# EAGLE design battery (EAGLE 9.5.0)
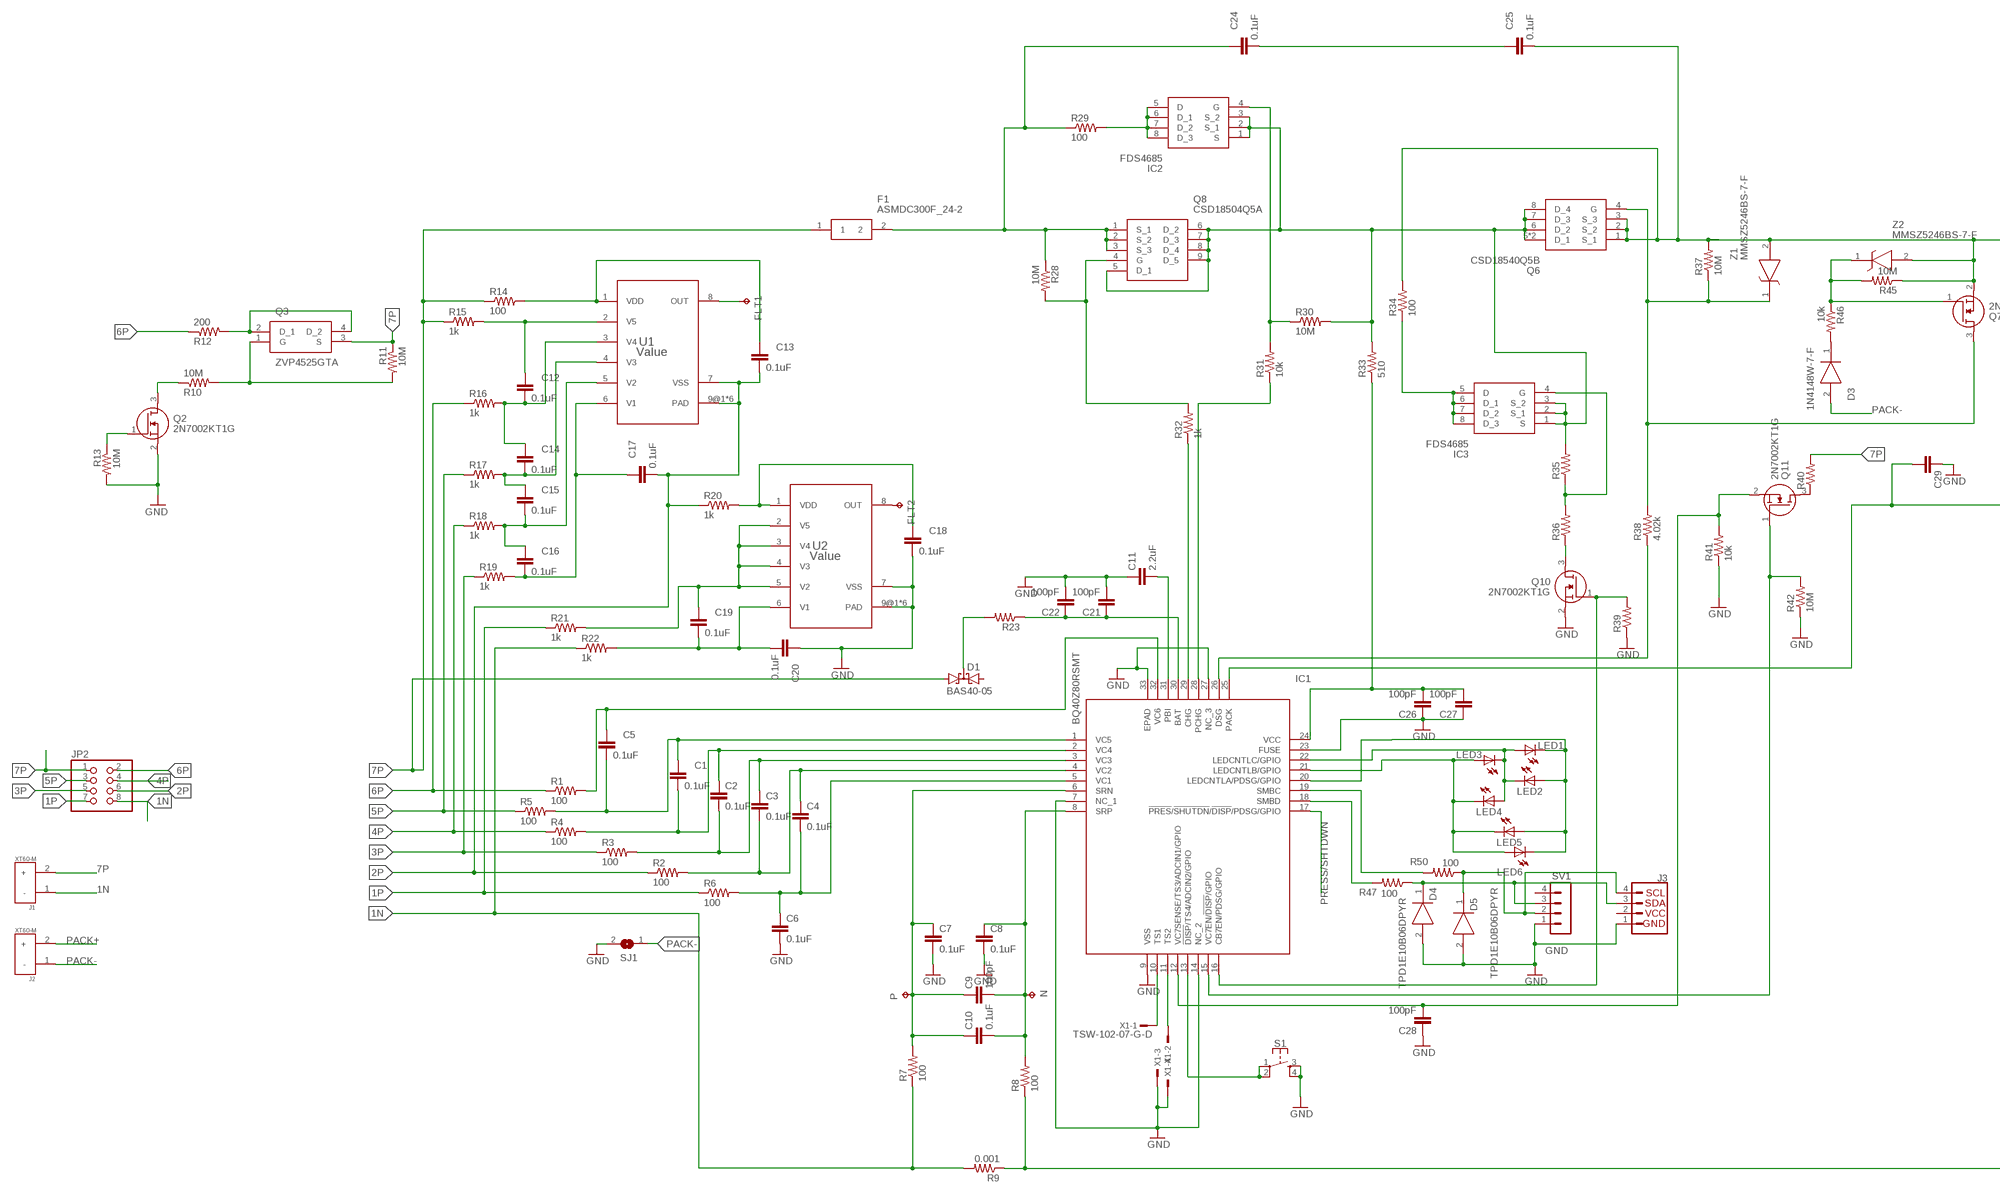
[diagram p0: schematic, sheet 1, part 1 of 2]
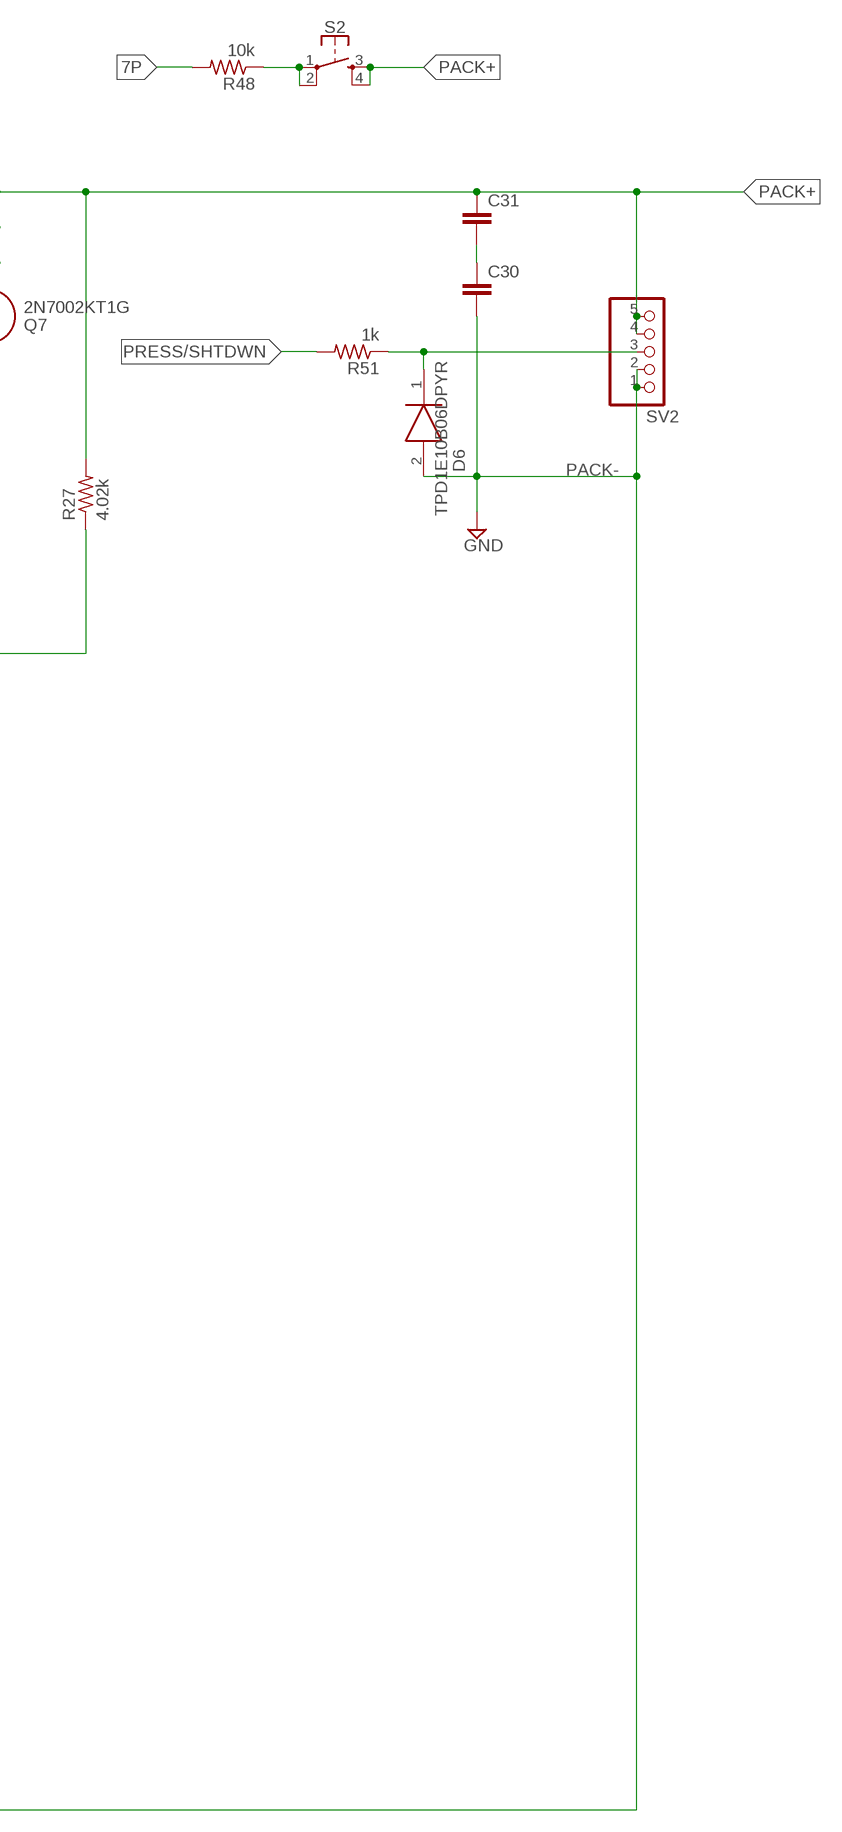
[diagram p1: schematic, sheet 1, part 2 of 2]

## Parts
C1  0.1uF  C-EUC0603  [C0603]
C2  0.1uF  C-EUC0603  [C0603]
C3  0.1uF  C-EUC0603  [C0603]
C4  0.1uF  C-EUC0603  [C0603]
C5  0.1uF  C-EUC0603  [C0603]
C6  0.1uF  C-EUC0603  [C0603]
C7  0.1uF  C-EUC0603  [C0603]
C8  0.1uF  C-EUC0603  [C0603]
C9  100pF  C-EUC0603  [C0603]
C10  0.1uF  C-EUC0603  [C0603]
C11  2.2uF  C-EUC1812  [C1812]
C12  0.1uF  C-EUC0603  [C0603]
C13  0.1uF  C-EUC0603  [C0603]
C14  0.1uF  C-EUC0603  [C0603]
C15  0.1uF  C-EUC0603  [C0603]
C16  0.1uF  C-EUC0603  [C0603]
C17  0.1uF  C-EUC0603  [C0603]
C18  0.1uF  C-EUC0603  [C0603]
C19  0.1uF  C-EUC0603  [C0603]
C20  0.1uF  C-EUC0603  [C0603]
C21  100pF  C-EUC0603  [C0603]
C22  100pF  C-EUC0603  [C0603]
C24  0.1uF  C-EUC0603  [C0603]
C25  0.1uF  C-EUC0603  [C0603]
C26  100pF  C-EUC0603  [C0603]
C27  100pF  C-EUC0603  [C0603]
C28  100pF  C-EUC0603  [C0603]
C29  C-EUC0603  [C0603]
C30  C-EUC0603  [C0603]
C31  C-EUC0603  [C0603]
D1  BAS40-05  [SOT23]
D3  1N4148W-7-F  [SOD3716X115N]
D4  TPD1E10B06DPYR  [DPY(R-PX1SON-N2)]
D5  TPD1E10B06DPYR  [DPY(R-PX1SON-N2)]
D6  TPD1E10B06DPYR  [DPY(R-PX1SON-N2)]
F1  ASMDC300F_24-2  [FUSC7551X110N]
FLT1  TPTP13R  [TP13R]
FLT2  TPTP13R  [TP13R]
IC1  BQ40Z80RSMT  [QFN40P400X400X100-33N]
IC2  FDS4685  [SOIC127P600X175-8N]
IC3  FDS4685  [SOIC127P600X175-8N]
J1  XT60-M  [AMASS_XT60-M]
J2  XT60-M  [AMASS_XT60-M]
J3  QWIIC_CONNECTORJS-1MM  [JST04_1MM_RA]
JP2  PINHD-2X4  [2X04]
LED1  LEDCHIPLED_0603  [CHIPLED_0603]
LED2  LEDCHIPLED_0603  [CHIPLED_0603]
LED3  LEDCHIPLED_0603  [CHIPLED_0603]
LED4  LEDCHIPLED_0603  [CHIPLED_0603]
LED5  LEDCHIPLED_0603  [CHIPLED_0603]
LED6  LEDCHIPLED_0603  [CHIPLED_0603]
N  TPTP13R  [TP13R]
P  TPTP13R  [TP13R]
Q2  2N7002KT1G  [SOT96P237X111-3N]
Q3  ZVP4525GTA  [SOT230P700X180-4N]
Q6  CSD18540Q5B  [Q5B]
Q7  2N7002KT1G  [SOT96P237X111-3N]
Q8  CSD18504Q5A  [CSD18514Q5AT]
Q10  2N7002KT1G  [SOT96P237X111-3N]
Q11  2N7002KT1G  [SOT96P237X111-3N]
R1  100  R-US_R0603  [R0603]
R2  100  R-US_R0603  [R0603]
R3  100  R-US_R0603  [R0603]
R4  100  R-US_R0603  [R0603]
R5  100  R-US_R0603  [R0603]
R6  100  R-US_R0603  [R0603]
R7  100  R-US_R0603  [R0603]
R8  100  R-US_R0603  [R0603]
R9  0.001  R-US_R1210  [R1210]
R10  10M  R-US_R0603  [R0603]
R11  10M  R-US_R0603  [R0603]
R12  200  R-US_R0603  [R0603]
R13  10M  R-US_R0603  [R0603]
R14  100  R-US_R0603  [R0603]
R15  1k  R-US_R0603  [R0603]
R16  1k  R-US_R0603  [R0603]
R17  1k  R-US_R0603  [R0603]
R18  1k  R-US_R0603  [R0603]
R19  1k  R-US_R0603  [R0603]
R20  1k  R-US_R0603  [R0603]
R21  1k  R-US_R0603  [R0603]
R22  1k  R-US_R0603  [R0603]
R23  R-US_R0603  [R0603]
R27  4.02k  R-US_R0603  [R0603]
R28  10M  R-US_R0603  [R0603]
R29  100  R-US_R1210  [R1210]
R30  10M  R-US_R0603  [R0603]
R31  10k  R-US_R0603  [R0603]
R32  1k  R-US_R0603  [R0603]
R33  510  R-US_R0603  [R0603]
R34  100  R-US_R1210  [R1210]
R35  R-US_R0603  [R0603]
R36  R-US_R0603  [R0603]
R37  10M  R-US_R0603  [R0603]
R38  4.02k  R-US_R0603  [R0603]
R39  R-US_R0603  [R0603]
R40  R-US_R0603  [R0603]
R41  10k  R-US_R0603  [R0603]
R42  10M  R-US_R0603  [R0603]
R45  10M  R-US_R0603  [R0603]
R46  10k  R-US_R0603  [R0603]
R47  100  R-US_R0603  [R0603]
R48  10k  R-US_R0603  [R0603]
R50  100  R-US_R0603  [R0603]
R51  1k  R-US_R0603  [R0603]
S1  MOMENTARY-SWITCH-SPST-2-SMD-4.6X2.8MM  [TACTILE_SWITCH_SMD_4.6X2.8MM]
S2  MOMENTARY-SWITCH-SPST-2-SMD-4.6X2.8MM  [TACTILE_SWITCH_SMD_4.6X2.8MM]
SJ1  SJ  [SJ]
SV1  MA04-1  [MA04-1]
SV2  PINHD-1X55X2MM  [1_05X2MM]
U1  Value  BQ771800DPJR  [DPJ0008A]
U2  Value  BQ771800DPJR  [DPJ0008A]
X1  TSW-102-07-G-D  [TSW-102-XX-G-D]
Z1  MMSZ5246BS-7-F  [SOD2513X110N]
Z2  MMSZ5246BS-7-F  [SOD2513X110N]

## Nets
1N: J1.1(-) JP2.8 R7.1 R9.2 R22.1
1P: JP2.7 R6.1 R21.1
2P: C13.2 C17.2 JP2.6 R2.1 R20.1 U1.7(VSS) U1.9@1(PAD) U1.9@2(PAD) U1.9@3(PAD) U1.9@4(PAD) U1.9@5(PAD) U1.9@6(PAD)
3P: JP2.5 R3.1 R19.1
4P: JP2.4 R4.1 R18.1
5P: JP2.3 R5.1 R17.1
6P: JP2.2 R1.1 R12.1 R16.1
7P: D1.1(A1) F1.1 J1.2(+) JP2.1 Q3.3(S) R11.1 R14.1 R15.1 R40.2 R48.2
GND: C6.2 C7.2 C8.2 C11.1 C18.2 C20.1 C21.2 C22.2 C26.1 C27.1 C28.1 C29.1 D4.2(GND) D5.2(GND) IC1.7(NC_1) IC1.9(VSS) IC1.14(NC_2) IC1.23(FUSE) IC1.27(NC_3) IC1.33(EPAD) J3.1 Q2.2(S) Q10.2(S) R13.2 R39.1 R41.1 R42.1 S1.3 S1.4 SJ1.2 SV1.1 U2.7(VSS) U2.9@1(PAD) U2.9@2(PAD) U2.9@3(PAD) U2.9@4(PAD) U2.9@5(PAD) U2.9@6(PAD) X1.3 X1.4
N$1: C1.1 C5.2 IC1.1(VC5) R5.2
N$2: C1.2 C2.1 IC1.2(VC4) R4.2
N$3: C2.2 C3.1 IC1.3(VC3) R3.2
N$4: C3.2 C4.1 IC1.4(VC2) R2.2
N$5: Q2.1(G) R13.1
N$6: C5.1 IC1.32(VC6) R1.2
N$7: C4.2 C6.1 IC1.5(VC1) R6.2
N$8: Q3.1(G) R10.2 R11.2
N$9: Q2.3(D) R10.1
N$10: Q3.2(D_1) Q3.4(D_2) R12.2
N$11: C13.1 R14.2 U1.1(VDD)
N$12: C12.1 R15.2 U1.2(V5)
N$13: C7.1 C9.1 C10.1 IC1.6(SRN) P.TP R7.2
N$14: C8.1 C9.2 C10.2 IC1.8(SRP) N.TP R8.2
N$15: C12.2 C14.1 R16.2 U1.3(V4)
N$17: C11.2 IC1.31(PBI)
N$18: D1.3(C) R23.2
N$19: C14.2 C15.1 R17.2 U1.4(V3)
N$20: C26.2 C27.2 IC1.24(VCC) R33.1
N$21: C15.2 C16.1 R18.2 U1.5(V2)
N$22: C21.1 C22.1 IC1.30(BAT) R23.1
N$23: FLT2.TP U2.8(OUT)
N$24: C16.2 C17.1 R19.2 U1.6(V1)
N$25: C18.1 R20.2 U2.1(VDD)
N$27: C19.1 R21.2 U2.2(V5) U2.3(V4) U2.4(V3) U2.5(V2)
N$28: FLT1.TP U1.8(OUT)
N$30: C19.2 C20.2 R22.2 U2.6(V1)
N$33: C24.1 F1.2 Q8.1(S_1) Q8.2(S_2) Q8.3(S_3) R28.1 R29.1
N$34: Q8.4(G) R28.2 R32.2
N$35: IC2.5(D) IC2.6(D_1) IC2.7(D_2) IC2.8(D_3) R29.2
N$36: D3.1(K) R46.2
N$37: C24.2 C25.1
N$38: IC2.1(S) IC2.2(S_1) IC2.3(S_2) IC3.1(S) IC3.2(S_1) IC3.3(S_2) Q6.5(D_1) Q6.6(D_2) Q6.7(D_3) Q6.8(D_4) Q6.9(D_1) Q8.5(D_1) Q8.6(D_2) Q8.7(D_3) Q8.8(D_4) Q8.9(D_5) R30.2 R33.2 R35.2
N$39: IC2.4(G) R30.1 R31.2
N$40: IC1.29(CHG) R32.1
N$41: IC1.28(PCHG) R31.1
N$43: IC3.5(D) IC3.6(D_1) IC3.7(D_2) IC3.8(D_3) R34.1
N$44: D4.1(I/O) J3.3 R47.1 SV1.3
N$45: Q6.4(G) Q7.3(D) R37.1 R38.2 Z1.1(K)
N$46: IC3.4(G) R35.1 R36.2
N$47: Q10.3(D) R36.1
N$48: IC1.26(DSG) R38.1
N$49: IC1.16(CB7EN/PDSG/GPIO) Q10.1(G) R39.2
N$50: Q11.3(D) R40.1
N$51: C28.2 IC1.12(VC7SENSE/TS3/ADCIN1/GPIO) Q11.2(S) R41.2
N$52: IC1.15(VC7EN/!DISP!/GPIO) Q11.1(G) R42.2
N$53: Q7.1(G) R45.2 R46.1 Z2.1(K)
N$54: IC1.10(TS1) X1.1
N$55: IC1.11(TS2) X1.2
N$56: D5.1(I/O) J3.4 R50.1 SV1.2
N$57: IC1.20(LEDCNTLA/PDSG/GPIO) LED1.C LED2.A LED5.A LED6.C
N$58: IC1.21(LEDCNTLB/GPIO) LED3.A LED4.C LED5.C LED6.A
N$59: IC1.18(SMBD) R47.2
N$60: R48.1 S2.1 S2.2
N$61: C29.2 IC1.25(PACK) R27.1
N$62: IC1.22(LEDCNTLC/GPIO) LED1.A LED2.C LED3.C LED4.A
N$63: D6.1(I/O) R51.1 SV2.3
N$64: IC1.19(SMBC) R50.2
N$67: IC1.13(!DISP!/TS4/ADCIN2/GPIO) S1.1 S1.2
N$68: C30.1 C31.2
PACK+: C25.2 C31.1 J2.2(+) Q6.1(S_1) Q6.2(S_2) Q6.3(S_3) Q7.2(S) R27.2 R34.2 R37.2 R45.1 S2.3 S2.4 SV2.4 SV2.5 Z1.2(A) Z2.2(A)
PACK-: C30.2 D3.2(A) D6.2(GND) J2.1(-) R8.1 R9.1 SJ1.1 SV2.1 SV2.2 ; supply symbol labelled GND
PRESS/SHTDWN: IC1.17(!PRES!/!SHUTDN!/!DISP!/PDSG/GPIO) R51.2
Unconnected: D1.2(A2) SV1.4

## Power pins joined to a net without a drawn wire
2: J3.2

## Library data of the parts
C1-C22 C24-C31 = rcl:C-EU: CAPACITOR, European symbol; SPICEPREFIX: C
D1 = diode:BAS40-05: Silicon Schottky Diodes General-purpose diode for high-speed switching
D3 = SamacSys_Parts:1N4148W-7-F: Diode Switching 150mA 100V 400mW SOD123 Diodes Inc 1N4148W-7-F Switching Diode 100V, 2-Pin SOD-123 Source: Datasheet <https://componentsearchengine.com/Datasheets/1/1N4148W-7-F.pdf>; DESCRIPTION: Diode Switching 150mA 100V 400mW SOD123 Diodes Inc 1N4148W-7-F Switching Diode 100V, 2-Pin SOD-123; HEIGHT: 1.15mm; MANUFACTURER_NAME: Diodes Inc.; MANUFACTURER_PART_NUMBER: 1N4148W-7-F; MOUSER_PART_NUMBER: 621-1N4148W-F; MOUSER_PRICE-STOCK: https://www.mouser.com/Search/Refine.aspx?Keyword=621-1N4148W-F
D4-D6 = SamacSys_Parts:TPD1E10B06DPYR: Texas Instruments,TPD1E10B06DPYR,IC,ESD Texas Instruments TPD1E10B06DPYR Bi-Directional ESD Protection Diode, 90W peak, 2-Pin X2SON Source: Datasheet <http://www.ti.com/lit/ds/symlink/tpd1e10b06.pdf>; DESCRIPTION: Texas Instruments,TPD1E10B06DPYR,IC,ESD Texas Instruments TPD1E10B06DPYR Bi-Directional ESD Protection Diode, 90W peak, 2-Pin X2SON; HEIGHT: mm; MANUFACTURER_NAME: Texas Instruments; MANUFACTURER_PART_NUMBER: TPD1E10B06DPYR; MOUSER_PART_NUMBER: 595-TPD1E10B06DPYR; MOUSER_PRICE-STOCK: https://www.mouser.com/Search/Refine.aspx?Keyword=595-TPD1E10B06DPYR
F1 = SamacSys_Parts:ASMDC300F_24-2: Resettable Fuses - PPTC 3A 24VDC 40A 2920 AEC-Q200 Source: Datasheet <https://componentsearchengine.com/Datasheets/1/ASMDC300F_24-2.pdf>; DESCRIPTION: Resettable Fuses - PPTC 3A 24VDC 40A 2920 AEC-Q200; HEIGHT: 1.1mm; MANUFACTURER_NAME: LITTELFUSE; MANUFACTURER_PART_NUMBER: ASMDC300F/24-2; MOUSER_PART_NUMBER: 650-ASMDC300F/24-2; MOUSER_PRICE-STOCK: https://www.mouser.com/Search/Refine.aspx?Keyword=650-ASMDC300F%2F24-2
FLT1 FLT2 N P = testpad:TP: Test pad
IC1 = SamacSys_Parts:BQ40Z80RSMT: 2-Series to 7-Series Battery Pack Manager with Impedance Track Gas Gauging Source: Datasheet <http://www.ti.com/lit/gpn/BQ40Z80>; DESCRIPTION: 2-Series to 7-Series Battery Pack Manager with Impedance Track Gas Gauging; HEIGHT: 1mm; MANUFACTURER_NAME: Texas Instruments; MANUFACTURER_PART_NUMBER: BQ40Z80RSMT; MOUSER_PART_NUMBER: 595-BQ40Z80RSMT; MOUSER_PRICE-STOCK: https://www.mouser.com/Search/Refine.aspx?Keyword=595-BQ40Z80RSMT
IC2 IC3 = SamacSys_Parts:FDS4685: FDS4685, P-channel MOSFET Transistor 8.2A 40V, 8-Pin SOIC Source: Datasheet <http://docs-emea.rs-online.com/webdocs/0d23/0900766b80d234a2.pdf>; DESCRIPTION: FDS4685, P-channel MOSFET Transistor 8.2A 40V, 8-Pin SOIC; HEIGHT: 1.75mm; MANUFACTURER_NAME: Fairchild Semiconductor; MANUFACTURER_PART_NUMBER: FDS4685; MOUSER_PART_NUMBER: 512-FDS4685; MOUSER_PRICE-STOCK: https://www.mouser.com/Search/Refine.aspx?Keyword=512-FDS4685
J1 J2 = XT60-M:XT60-M: DC supply; XT60; male; PIN:2; for cable; soldered; 60A; 500V; AVAILABILITY: Unavailable; MF: AMASS; MP: XT60-M; PACKAGE: Package Analog Devices; PRICE: None
J3 = SparkFun-Connectors:QWIIC_CONNECTOR: SparkFun I2C Standard Qwiic Connector An SMD 1mm pitch JST connector makes it easy and quick (get it? Qwiic?) to connect I2C devices to each other. The Qwiic system <http://www.sparkfun.com/qwiic> enables fast and solderless connection between popular platforms and various sensors and actuators. We carry 200mm <https://www.sparkfun.com/products/14204>, 100mm <https://www.sparkfun.com/products/14205>, 50mm <https://www.sparkfun.com/products/14206>, and breadboard friendly <https://www.sparkfun.com/products/14207> Qwiic cables. We also offer 10 pcs strips <https://www.sparkfun.com/products/14323> the SMD connectors.; PROD_ID: CONN-13694
JP2 = pinhead:PINHD-2X4: PIN HEADER
LED1-LED6 = adafruit:LED: LED OSRAM: - CHIPLED LG R971, LG N971, LY N971, LG Q971, LY Q971, LO R971, LY R971 LH N974, LH R974 LS Q976, LO Q976, LY Q976 LO Q996 - Hyper CHIPLED LW Q18S LB Q993, LB Q99A, LB R99A - SideLED LS A670, LO A670, LY A670, LG A670, LP A670 LB A673, LV A673, LT A673, LW A673 LH A674 LY A675 LS A676, LA A676, LO A676, LY A676, LW A676 LS A679, LY A679, LG A679 - Hyper Micro SIDELED® LS Y876, LA Y876, LO Y876, LY Y876 LT Y87S - SmartLED LW L88C, LW L88S LB L89C, LB L89S, LG L890 LS L89K, LO L89K, LY L89K LS L896, LA L896, LO L896, LY L896 - TOPLED LS T670, LO T670, LY T670, LG T670, LP T670 LSG T670, LSP T670, LSY T670, LOP T670, LYG T670 LG T671, LOG T671, LSG T671 LB T673, LV T673, LT T673, LW T673 LH T674 LS T676, LA T676, LO T676, LY T676, LB T676, LH T676, LSB T676, LW T676 LB T67C, LV T67C, LT T67C, LS T67K, LO T67K, LY T67K, LW E67C LS E67B, LA E67B, LO E67B, LY E67B, LB E67C, LV E67C, LT E67C LW T67C LS T679, LY T679, LG T679 LS T770, LO T770, LY T770, LG T770, LP T770 LB T773, LV T773, LT T773, LW T773 LH T774 LS E675, LA E675, LY E675, LS T675 LS T776, LA T776, LO T776, LY T776, LB T776 LHGB T686 LT T68C, LB T68C - Hyper Mini TOPLED® LB M676 - Mini TOPLED Santana® LG M470 LS M47K, LO M47K, LY M47K Source: http://www.osram.convergy.de/
Q2 Q7 Q10 Q11 = SamacSys_Parts:2N7002KT1G: MOSFET N-Ch 60V 380mA Small Signal SOT23 ON Semiconductor 2N7002KT1G N-channel MOSFET Transistor, 380 mA, 60 V, 3-Pin SOT-23 Source: Datasheet <https://componentsearchengine.com/Datasheets/1/2N7002KT1G.pdf>; DESCRIPTION: MOSFET N-Ch 60V 380mA Small Signal SOT23 ON Semiconductor 2N7002KT1G N-channel MOSFET Transistor, 380 mA, 60 V, 3-Pin SOT-23; HEIGHT: 1.11mm; MANUFACTURER_NAME: ON Semiconductor; MANUFACTURER_PART_NUMBER: 2N7002KT1G; MOUSER_PART_NUMBER: 863-2N7002KT1G; MOUSER_PRICE-STOCK: https://www.mouser.com/Search/Refine.aspx?Keyword=863-2N7002KT1G
Q3 = SamacSys_Parts:ZVP4525GTA: Diodes Inc ZVP4525GTA P-channel MOSFET Transistor, 0.26 A, 250 V, 3 + Tab-Pin SOT-223 Source: Datasheet <https://componentsearchengine.com/Datasheets/1/ZVP4525GTA.pdf>; DESCRIPTION: Diodes Inc ZVP4525GTA P-channel MOSFET Transistor, 0.26 A, 250 V, 3 + Tab-Pin SOT-223; HEIGHT: 1.8mm; MANUFACTURER_NAME: Diodes Inc.; MANUFACTURER_PART_NUMBER: ZVP4525GTA; MOUSER_PART_NUMBER: 522-ZVP4525GTA; MOUSER_PRICE-STOCK: https://www.mouser.com/Search/Refine.aspx?Keyword=522-ZVP4525GTA
Q6 = SamacSys_Parts:CSD18540Q5B: 60V, N ch NexFET MOSFET, single SON5x6, 2.2mOhm Source: Datasheet <http://www.ti.com/lit/ds/symlink/csd18540q5b.pdf>; DESCRIPTION: 60V, N ch NexFET MOSFET, single SON5x6, 2.2mOhm; HEIGHT: mm; MANUFACTURER_NAME: Texas Instruments; MANUFACTURER_PART_NUMBER: CSD18540Q5B; MOUSER_PART_NUMBER: 595-CSD18540Q5B; MOUSER_PRICE-STOCK: https://www.mouser.com/Search/Refine.aspx?Keyword=595-CSD18540Q5B
Q8 = SamacSys_Parts:CSD18504Q5A: Texas Instruments CSD18504Q5A N-channel MOSFET Transistor, 75 A, 40 V, 8-Pin SON Source: Datasheet <http://www.ti.com/lit/gpn/csd18504q5a>; DESCRIPTION: Texas Instruments CSD18504Q5A N-channel MOSFET Transistor, 75 A, 40 V, 8-Pin SON; HEIGHT: 1.1mm; MANUFACTURER_NAME: Texas Instruments; MANUFACTURER_PART_NUMBER: CSD18504Q5A; MOUSER_PART_NUMBER: 595-CSD18504Q5A; MOUSER_PRICE-STOCK: https://www.mouser.com/Search/Refine.aspx?Keyword=595-CSD18504Q5A
R1-R23 R27-R42 R45-R48 R50 R51 = rcl:R-US_: RESISTOR, American symbol; SPICEPREFIX: R
S1 S2 = SparkFun-Switches:MOMENTARY-SWITCH-SPST-2: Momentary Switch (Pushbutton) - SPST - Two Circuits Normally-open (NO) SPST momentary switches (buttons, pushbuttons). Schematic symbol includes two switch circuits. Variants SMD-4.6MMX2.8MM - 4.60mm x 2.80mm Tactile Momentary Button Switch - Used on SparkFun SAMD21 Mini Breakout <https://www.sparkfun.com/products/13664> SMD-5.2MM - Mini Pushbutton Switch - SMD <https://www.sparkfun.com/products/8720> - Used on Arduino Pro Mini <https://www.sparkfun.com/products/11114>; PROD_ID: SWCH-13065
SJ1 = jumper:SJ: SMD solder JUMPER
SV1 = con-lstb:MA04-1: PIN HEADER; OC_FARNELL: unknown; OC_NEWARK: unknown
SV2 = pinhead:PINHD-1X5: PIN HEADER
U1 U2 = bq7718:BQ771800DPJR; MANUFACTURER: Texas Instruments; PARTNUMBER: BQ771800DPJR; REFDES: RefDes; TYPE: TYPE
X1 = con-samtec:TSW-102-*-G: THROUGH-HOLE .025" SQ POST HEADER Source: Samtec TSW.pdf; MF: Samtec Inc.; MPN: TSW-102-07-G-D
Z1 Z2 = SamacSys_Parts:MMSZ5246BS-7-F: Zener Diodes 200MW 16V Source: Datasheet <https://www.diodes.com/assets/Datasheets/ds31038.pdf>; DESCRIPTION: Zener Diodes 200MW 16V; HEIGHT: 1.1mm; MANUFACTURER_NAME: Diodes Inc.; MANUFACTURER_PART_NUMBER: MMSZ5246BS-7-F; MOUSER_PART_NUMBER: 621-MMSZ5246BS-7-F; MOUSER_PRICE-STOCK: https://www.mouser.com/Search/Refine.aspx?Keyword=621-MMSZ5246BS-7-F

## Board
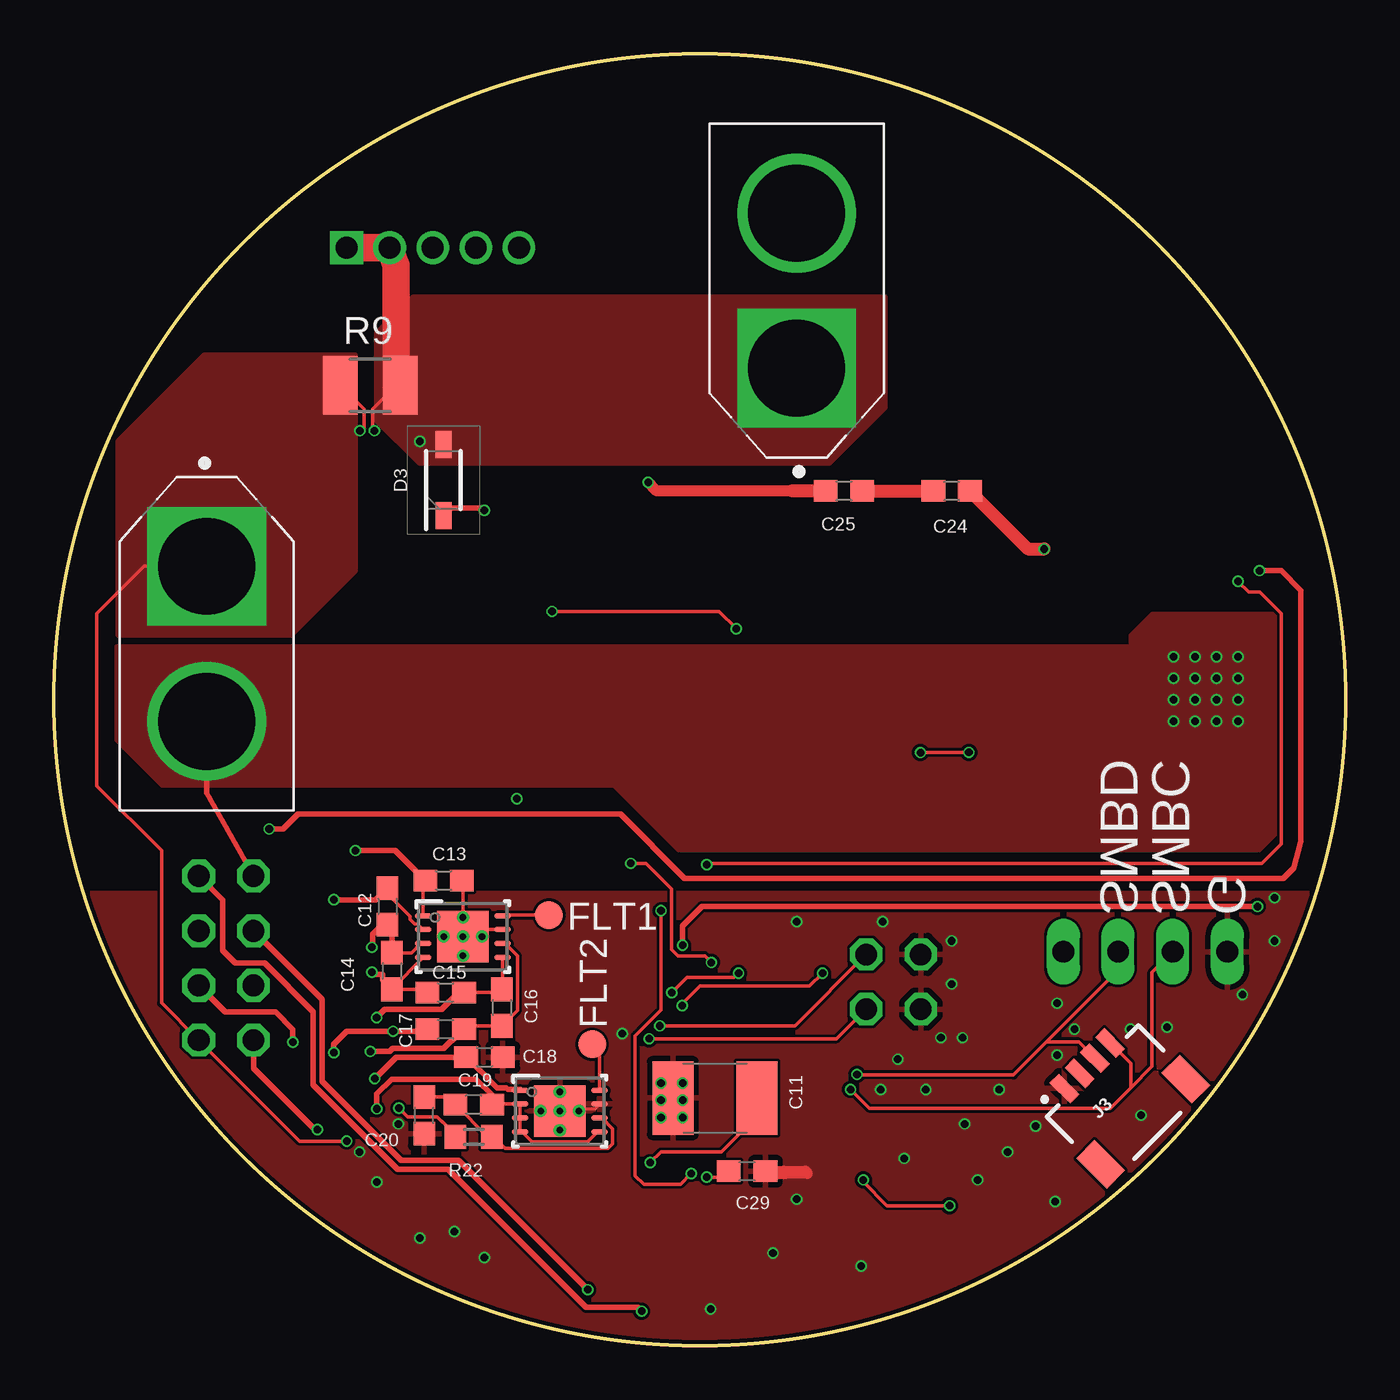
[diagram p2: board, top side]
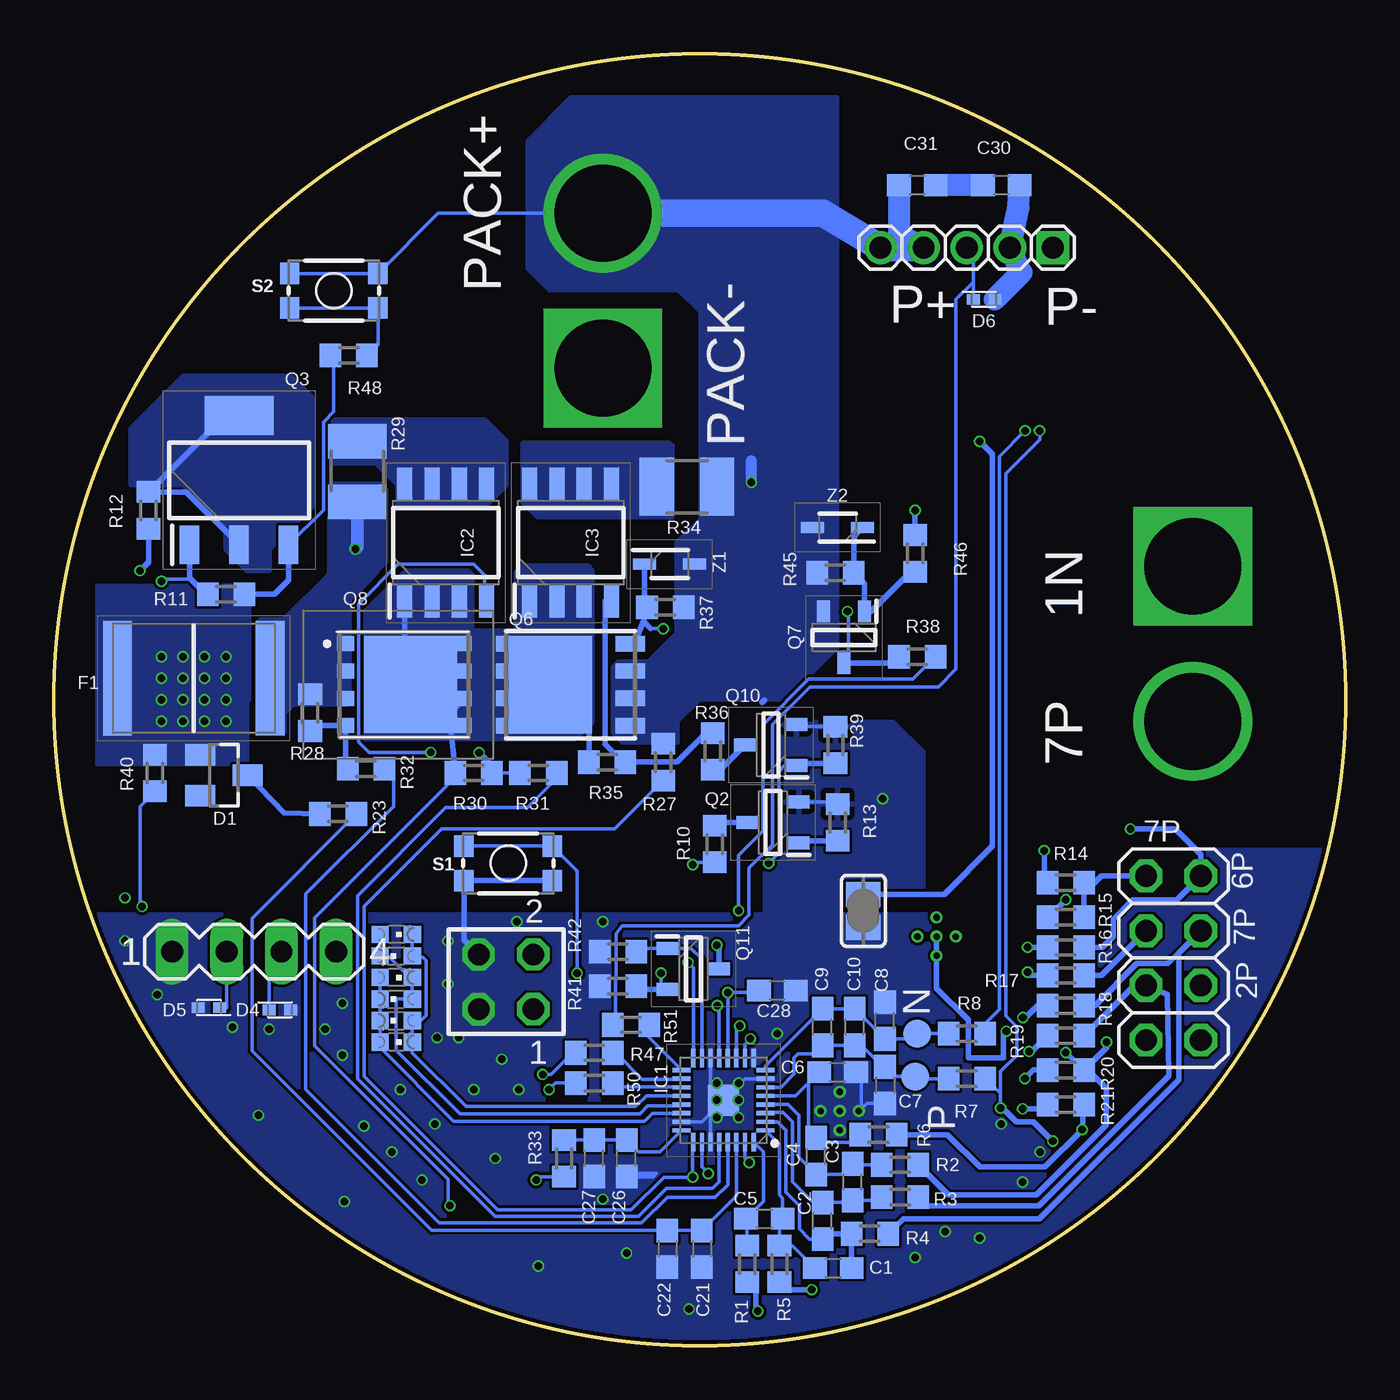
[diagram p3: board, bottom side, seen from below]

Size 60 x 60 mm. Coordinates in mm from the lower left corner, seen from the top.
Outline: circle at 30,30 radius 30
Copper layers (1*16): Top 0.035559375mm / dielectric 1.6mm / Bottom 0.035559375mm
Design rules "jlcpcb2layer": minimum track width 5mil, minimum drill 12mil, track to track 5mil, track to pad 5mil, pad to pad 5mil, via to via 5mil, smd to smd 5mil, copper to edge 8mil, drill to drill 6mil, minimum pad ring 5mil, minimum via ring 3mil, stop-mask expansion 2.5mil, vias tented up to drill 0mil, thermal gap 10mil

### Footprints (pad centres in the part's own frame; a part is rotated, then mirrored left to right if it is on the bottom)
C0603 = smd 1.1 x 1: 1 -0.85,0; 2 0.85,0
C1812 = smd 1.9 x 3.4: 1 -1.95,0; 2 1.95,0
SOT23 = smd 1 x 1.4: 1 -0.95,-1.1; 2 0.95,-1.1; 3 0,1.1
SOD3716X115N = smd 1.25 x 0.75: 1 -1.65,0; 2 1.65,0
DPY(R-PX1SON-N2) = smd 0.6 x 0.5: 1 -0.5,0; 2 0.5,0
FUSC7551X110N = smd 1.33 x 5.32: 1 -3.545,0; 2 3.545,0
TP13R = smd 1.3 x 1.3: TP 0,0
QFN40P400X400X100-33N = smd 0.85 x 0.2: 1 -1.95,1.4; 2 -1.95,1; 3 -1.95,0.6; 4 -1.95,0.2; 5 -1.95,-0.2; 6 -1.95,-0.6; 7 -1.95,-1; 8 -1.95,-1.4; 17 1.95,-1.4; 18 1.95,-1; 19 1.95,-0.6; 20 1.95,-0.2; 21 1.95,0.2; 22 1.95,0.6; 23 1.95,1; 24 1.95,1.4 | smd 0.2 x 0.85: 9 -1.4,-1.95; 10 -1,-1.95; 11 -0.6,-1.95; 12 -0.2,-1.95; 13 0.2,-1.95; 14 0.6,-1.95; 15 1,-1.95; 16 1.4,-1.95; 25 1.4,1.95; 26 1,1.95; 27 0.6,1.95; 28 0.2,1.95; 29 -0.2,1.95; 30 -0.6,1.95; 31 -1,1.95; 32 -1.4,1.95 | smd 1.45 x 1.45: 33 0,0
SOIC127P600X175-8N = smd 1.525 x 0.7: 1 -2.712,1.905; 2 -2.712,0.635; 3 -2.712,-0.635; 4 -2.712,-1.905; 5 2.712,-1.905; 6 2.712,-0.635; 7 2.712,0.635; 8 2.712,1.905
AMASS_XT60-M = drill 4.5 square: 1 -3.6,0 | drill 4.5: 2 3.6,0
JST04_1MM_RA = smd 0.6 x 1.35: 1 -1.5,0; 2 -0.5,0; 3 0.5,0; 4 1.5,0 | smd 1.2 x 2: NC1 2.8,-3.675; NC2 -2.8,-3.675
2X04 = drill 1.016 octagon: 1 -3.81,-1.27; 2 -3.81,1.27; 3 -1.27,-1.27; 4 -1.27,1.27; 5 1.27,-1.27; 6 1.27,1.27; 7 3.81,-1.27; 8 3.81,1.27
CHIPLED_0603 = smd 0.8 x 0.8: A 0,-0.75; C 0,0.75
SOT96P237X111-3N = smd 1 x 0.6: 1 -1.2,0.955; 2 -1.2,-0.955; 3 1.2,0
SOT230P700X180-4N = smd 1.8 x 0.9: 1 -3,2.3; 2 -3,0; 3 -3,-2.3 | smd 1.8 x 3.2: 4 3,0
Q5B = smd 1.372 x 0.71: 1 2.77,-1.905; 2 2.77,-0.635; 3 2.77,0.635; 4 2.77,1.905 | smd 0.59 x 0.71: 5 -3.161,1.905; 6 -3.161,0.635; 7 -3.161,-0.635; 8 -3.161,-1.905 | smd 3.85 x 4.52: 9 -0.936,0
CSD18514Q5AT = smd 0.8 x 0.7: 1 2.451,-1.905; 2 2.451,-0.635; 3 2.451,0.635; 4 2.451,1.905 | smd 0.68 x 0.7: 5 -3.064,1.905; 6 -3.064,0.635; 7 -3.064,-0.635; 8 -3.064,-1.905 | smd 4.32 x 4.51: 9 -0.564,0
R0603 = smd 1 x 1.1: 1 -0.85,0; 2 0.85,0
R1210 = smd 1.6 x 2.7: 1 -1.4,0; 2 1.4,0
TACTILE_SWITCH_SMD_4.6X2.8MM = smd 0.9 x 1: 1 -2.05,-0.8; 2 2.05,-0.8; 3 2.05,0.8; 4 -2.05,0.8
SJ = smd 1.168 x 1.6: 1 -0.762,0; 2 0.762,0
MA04-1 = drill 1.016 long: 1 -3.81,0; 2 -1.27,0; 3 1.27,0; 4 3.81,0
1_05X2MM = drill 1.016 pad 1.3 square: 1 -4,0 | drill 1.016 pad 1.3: 2 -2,0; 3 0,0; 4 2,0; 5 4,0
DPJ0008A = smd 0.762 x 0.25: 1 -1.85,0.95; 2 -1.85,0.325; 3 -1.85,-0.325; 4 -1.85,-0.975; 5 1.85,-0.975; 6 1.85,-0.325; 7 1.85,0.325; 8 1.85,0.95 | smd 2.4 x 2.4: 9@1 0,0 | drill 0.305 pad 0.406: 9@2 -0.889,0; 9@3 0,-0.889; 9@4 0.889,0; 9@5 0,0; 9@6 0,0.889
TSW-102-XX-G-D = drill 1 pad 1.5 octagon: 1 1.27,-1.27; 2 1.27,1.27; 3 -1.27,-1.27; 4 -1.27,1.27
SOD2513X110N = smd 1.075 x 0.5: 1 -1.162,0; 2 1.162,0

### Placement (x,y rotation side)
C1  23.8,3.6 0 bottom
C2  24.3,5.8 90 bottom
C3  22.9,7.6 90 bottom
C4  24.6,8.8 90 bottom
C5  27,5.9 0 bottom
C6  23.6,12.7 0 bottom
C7  21.4,12.1 270 bottom
C8  21.4,15.1 90 bottom
C9  24.3,14.8 90 bottom
C10  22.8,14.8 90 bottom
C11  30.7,11.5 0 top
C12  15.5,20.4 270 top
C13  18.1,21.6 0 top
C14  15.7,17.4 270 top
C15  18.2,16.4 0 top
C16  20.8,15.7 270 top
C17  18.2,14.7 180 top
C18  20,13.4 0 top
C19  19.5,11.2 180 top
C20  17.2,10.7 90 top
C21  29.9,4.5 270 bottom
C22  31.5,4.5 270 bottom
C24  41.7,39.7 180 top
C25  36.7,39.7 180 top
C26  33.4,8.7 90 bottom
C27  34.9,8.7 90 bottom
C28  26.4,16.5 180 bottom
C29  32.2,8.1 180 top
C30  16,53.9 0 bottom
C31  19.9,53.9 0 bottom
D1  52.1,26.5 270 bottom
D3  18.1,40.2 90 top
D4  49.5,15.6 0 bottom
D5  52.8,15.7 180 bottom
D6  16.8,48.6 0 bottom
F1  53.5,31 0 bottom
FLT1  23,20 0 top
FLT2  25,14 0 top
IC1  28.9,11.4 180 bottom
IC2  41.8,37.3 90 bottom
IC3  36,37.3 90 bottom
J1  7.1,32.6 270 top
J2  34.5,49 90 top
J3  48,13 45 top
JP2  8,18 270 bottom
LED1  44.1,14.1 270 bottom
LED2  44.1,15.1 90 bottom
LED3  44.1,16.1 90 bottom
LED4  44.1,17.1 270 bottom
LED5  44.1,18.1 90 bottom
LED6  44.1,19.1 270 bottom
N  19.9,14.5 180 bottom
P  20,12.5 180 bottom
Q2  26.6,24.3 180 bottom
Q3  51.4,40.2 90 bottom
Q6  36,30.7 0 bottom
Q7  23.3,32.9 270 bottom
Q8  44,30.7 180 bottom
Q10  26.7,27.9 180 bottom
Q11  30.3,17.5 0 bottom
R1  27.8,3.8 90 bottom
R2  20.7,8.4 180 bottom
R3  20.7,6.9 180 bottom
R4  22.1,5.2 180 bottom
R5  26.3,3.8 90 bottom
R6  21.7,9.8 180 bottom
R7  17.6,12.4 180 bottom
R8  17.6,14.5 180 bottom
R9  14.7,44.6 180 top
R10  29.3,23.3 270 bottom
R11  52,34.9 180 bottom
R12  55.6,38.8 90 bottom
R13  23.6,24.3 90 bottom
R14  13,21.5 180 bottom
R15  13,19.9 180 bottom
R16  13,18.5 180 bottom
R17  13,17.2 180 bottom
R18  13,15.8 180 bottom
R19  13,14.4 180 bottom
R20  13,12.8 180 bottom
R21  13,11.2 180 bottom
R22  19.5,9.7 0 top
R23  46.8,24.7 180 bottom
R27  31.7,27.1 90 bottom
R28  48.1,29.4 270 bottom
R29  45.9,40.6 90 bottom
R30  40.5,26.6 180 bottom
R31  37.5,26.6 180 bottom
R32  45.5,26.8 180 bottom
R33  36.3,8.7 270 bottom
R34  30.6,39.9 0 bottom
R35  34.3,27.1 180 bottom
R36  29.4,27.6 90 bottom
R37  31.6,34.3 0 bottom
R38  19.9,32 180 bottom
R39  23.7,27.9 270 bottom
R40  55.3,26.6 90 bottom
R41  33.8,16.7 0 bottom
R42  33.8,18.3 0 bottom
R45  23.7,35.9 0 bottom
R46  20,36.8 90 bottom
R47  34.9,13.6 0 bottom
R48  46.3,46 180 bottom
R50  34.9,12.2 0 bottom
R51  33.2,14.9 0 bottom
S1  38.9,22.4 180 bottom
S2  47,49 0 bottom
SJ1  22.4,20.2 270 bottom
SV1  50.7,18.3 0 bottom
SV2  17.6,51 180 bottom
U1  19,19 0 top
U2  23.5,10.9 0 top
X1  39,16.9 0 bottom
Z1  31.4,36.3 0 bottom
Z2  23.6,38 180 bottom

### Tracks (layer width: path | path; a pad name or v marks a point on that pad's centre or on a via)
1N  (via drill 0.35)
  Top 0.152: R9.2 14.4,43.5 14.4,42.5 v14.21,42.5 | v16.03,11.03 16.43,10.63 17.8,10.63 18.03,10.39 18.03,10.42 18.65,9.8 R22.1 | v13.6,9.5 11.42,9.5 JP2.8 5,15.92 5,23 2,26 2,34 4.2,36.2 J1.1
  Bottom 0.152: v14.21,42.5 14.21,42.09 15.79,40.51 15.79,15.32 15.27,14.8 15.27,13.49 16.03,12.73 v16.03,11.03 | 16.75,12.55 R7.1 16.7,12.4 16.03,11.73 v16.03,11.03 | v16.03,11.03 16,11
  Bottom 0.254: 16.6,12.4 R7.1 | v16.03,11.03 15.93,11.03 15.3,10.4 14.5,10.4 v13.6,9.5
  pour Top (no thermals): 3,33 3,42 7,46 14,46 14,36 11,33
1P  (via drill 0.35)
  Top 0.254: v12.24,10.04 12.14,10.04 9.29,12.89 9.27,12.96 JP2.7
  Bottom 0.254: R21.1 12.2,11.15 12.2,10.07 v12.24,10.04 13.97,8.3 17,8.3 18.5,9.8 R6.1
2P  (via drill 0.35)
  Top 0.152: U1.7 19.32,19.32 U1.9@5 19,21.55 C13.2 | v11.1,14.1 11.1,14.2 11.1,14.5
  Top 0.254: C17.2 17.25,14.6 v15.76,14.6 13.6,14.6 13,14 v13,13.61 | JP2.6 7.96,15.5 10.3,15.5 11.1,14.7 11.1,14.2
  Bottom 0.152: 11.98,12.8 R20.1 11.98,12.98
  Bottom 0.254: 11.98,12.8 11.12,11.95 11.12,10.25 14.38,7 18.45,7 R2.1 | v11.1,14.1 11.1,13.85 11.98,12.98 12.36,12.98 v13,13.61 | U1.9@5 19,16.6 17.53,15.13 17.53,13.37 15.89,13.37 15.89,14.46 v15.76,14.6
3P
  Bottom 0.152: 19.45,6.5 R3.1
  Bottom 0.254: 19.45,6.5 14.25,6.5 8.22,12.53 8.27,16.32 JP2.5 9.82,16.73 11.4,15.15 11.4,15.14 11.55,15 R19.1
4P
  Bottom 0.152: 11.68,15.8 12,15.8 R18.1
  Bottom 0.254: R4.1 20.55,5.9 14.21,5.9 7.76,12.36 7.76,18.24 | 12,15.8 11.64,15.8 9.69,17.75 8.25,17.75 7.76,18.24 | 7.76,18.24 JP2.4
5P  (via drill 0.35)
  Top 0.254: v24.8,2.6 18.8,8.6 16.13,8.6 12.46,12.28 12.46,16.08 JP2.3
  Bottom 0.152: JP2.3 9.27,19.23
  Bottom 0.254: R5.1 25.95,2.6 v24.8,2.6 | JP2.3 11.34,17.2 R17.1
6P  (via drill 0.35)
  Top 0.254: JP2.2 6.74,21.81 7.85,20.7 7.85,18.35 8.43,17.77 9.78,17.77 12.05,15.5 12.05,12.11 15.96,8.19 18.31,8.19 24.73,1.77 27.13,1.77 v27.3,1.6 | v10,24 10.66,24 11.34,24.69 26.31,24.69 29.3,21.7 57.1,21.7 57.59,22.19 57.92,23.42 57.92,35.08 57,36 v56,36
  Bottom 0.152: R16.1 11.8,18.5 11.52,18.5
  Bottom 0.254: R1.1 27.4,2.55 27.4,1.7 v27.3,1.6 | v10,24 7.92,24 6.73,22.81 JP2.2 7.84,20.7 9.9,20.7 10.8,19.8 10.8,19 11.3,18.5 11.8,18.5 | v56,36 55.6,36.4 R12.1
7P  (via drill 0.35)
  Top 0.254: JP2.1 7.1,25.66 J1.2
  Bottom 0.152: R14.1 12.15,21 R15.1 | Q3.3 47.48,38.82 47.48,42.89 47,43.37 47,45.85 R48.2
  Bottom 0.254: Q3.3 49.1,35.55 49.75,34.9 R11.1 | JP2.1 11.34,21.81 12.15,21 | R14.1 R15.1
  other vias: 54,31 55,31 55,32 54,32 53,32 52,32 52,31 53,31 53,30 52,30 52,29 53,29 54,29 54,30 55,30 55,29
  pour Top (no thermals): 2.9,32.5 50,32.5 50,33 51,34 57,34 57,24 56,23 29,23 26,26 5,26 2.9,28.1
  pour Bottom (no thermals): 51,29.9 51,27 58,27 58,35.3 50.9,35.3 50.9,30
GND  (via drill 0.35)
  Top 0.152: U2.7 25.12,11 24,11 24.1,10.9 U2.9@4
  Top 0.508: C29.1 33.9,8.1 34,8 | 34,8 33.15,8 C29.1 | C29.1 34.9,8.1 35,8 34,8
  Bottom 0.152: IC1.7 27.9,12.4 IC1.33 | IC1.33 29.5,12 IC1.14 | IC1.33 29.5,10.8 | 29.5,10.8 IC1.27 | R13.2 23.7,25.25 Q2.2 | Q10.2 25.39,28.75 R39.1 | 21.6,25.4 v21.5,25.4 | IC1.23 29.9,10.4 29.5,10.8 | U2.9@2 22.48,11 | 22.48,11 22.48,12.43 C6.2 | C7.2 22.23,11.25 22.48,11 | C26.1 32.15,7.85 32,8 33.25,8 C26.1
  Bottom 0.254: S1.4 S1.3 40.95,18.85 X1.4
  other vias: 17,5 18.6,5.3 20,4.1 30.5,1.7 28.2,12.2 28.2,11.4 28.2,10.6 29.2,10.6 29.2,11.4 29.2,12.2 26.4,14.5 33.4,4.3 14.2,9 15,7.6 16,10.3 34.5,6.8 38.5,19.7 34.5,19.7 37.5,3.7 39.5,8.7 50.5,10.7 46.6,13.5 55.2,16.3 50,14.7 43.9,11.9 42.3,10.3 40.5,11.9 38.4,11.9 46.6,15.9 46.5,6.7 42.2,14.3 41.2,14.3 39.2,13.3 51.7,14.8 56.7,18.8 56.7,20.8 41.7,18.8 41.7,16.8 45.6,10.2 44.3,9 42.9,7.7 47.4,14.7
  pour Bottom (no thermals): 14,-1 0,13 0,22 1,23 14,23 17,20 62,20 65,17 65,8 56,-1
  pour Top: -11,21 60,21 60,-3 -11,-3
  pour Bottom: 19.6,27.6 19.6,20 27,20 27,28 26,29 21,29
N$1
  Bottom 0.152: C5.2 25.85,6.2 25.82,6.18 | C1.1 25.7,4.65 R5.2 26.3,5.75 C5.2 | IC1.1 26.3,9.36 26.3,7 26.15,6.84 C5.2
N$2
  Bottom 0.152: C2.1 24.9,4.95 25.37,5.42 25.37,6.5 26,7.12 26,10 26.4,10.4 IC1.2 | R4.2 23.2,4.95
  Bottom 0.254: C1.2 R4.2 24.05,5.2 C2.1
N$3
  Bottom 0.152: IC1.3 26.92,10.83 26.13,10.83 25.7,10.4 25.7,7.61 24.75,6.65 C2.2 23,6.65 C3.1 21.7,6.75 R3.2
N$4
  Bottom 0.152: R2.2 22.85,8.4 C3.2 23.4,7.95 C4.1 25.4,8.75 25.4,10.7 25.9,11.2 IC1.4
N$5
  Bottom 0.254: R13.1 25.3,23.45 Q2.1
N$6
  Bottom 0.152: IC1.32 27.05,9 27.05,6.7 C5.1 27.8,5.85 R1.2
N$7
  Bottom 0.152: IC1.5 25.55,11.6 C6.1 24.95,12.2 24.95,10 C4.2 24.4,9.45 22.9,9.45 R6.2
N$8  (via drill 0.35)
  Top 0.152: v55,35.5 55.5,35 56,35 57,34 57,23.3 56.1,22.4 30.4,22.4 v30.33,22.34
  Bottom 0.152: 53,34.9 R11.2 53.55,35.6 55,35.6 v55,35.5 | v30.33,22.34 30.22,22.45 R10.2
  Bottom 0.254: Q3.1 53.7,35.65 52.95,34.9 R11.2
N$9
  Bottom 0.254: Q2.3 29.11,24.3 R10.1
N$10
  Bottom 0.254: Q3.4 52.05,43.2 R12.2 53.85,39.65 Q3.2
  pour Bottom (no thermals): 48,44 48,39 50,37 50,36 51,36 52,37 52,38 54,40 56.4,40 56.4,42.6 54,45 49,45
N$11  (via drill 0.35)
  Top 0.152: U1.1 17.15,21.5 C13.1
  Top 0.254: C13.1 15.85,23 v14,23
  Bottom 0.254: v14,23 14,21.65 R14.2
N$12  (via drill 0.35)
  Top 0.152: C12.1 15.5,20.98 16.54,19.94 16.54,19.8 16.75,19.6 16.88,19.6 U1.2
  Top 0.254: C12.1 14.95,20.7 13.01,20.7 v13,20.71
  Bottom 0.254: v13,20.71 13.81,19.9 R15.2
N$13
  Bottom 0.152: 21.05,12.6 C7.1 | C7.1 21.5,12.95 22.5,13.95 C10.1 C9.1 24.7,13.55 25.45,13.55 25.62,13.38 25.62,12.62 26.24,12 IC1.6 | R7.2 19.9,12.4 P.TP 20.95,12.5 C7.1
N$14
  Bottom 0.152: R8.2 N.TP 20.15,14.25 C8.1 C10.2 C9.2 26.95,13 IC1.8
N$15  (via drill 0.35)
  Top 0.152: U1.3 17.04,18.68 16.62,18.25 C14.1
  Top 0.254: v14.77,18.5 14.8,18.54 14.8,19.1 15.25,19.55 C12.2 15.7,19.35 C14.1
  Bottom 0.254: v14.77,18.5 R16.2
N$17  (via drill 0.35)
  Top 0.152: v27.7,8.5 28.19,9 31,9 32.65,10.65 C11.2
  Bottom 0.152: IC1.31 27.9,8.71 v27.7,8.5
N$18
  Bottom 0.254: D1.3 49.3,24.75 R23.2
N$19  (via drill 0.35)
  Top 0.152: U1.4 15.7,16.57 C14.2 17.2,16.55 C15.1
  Top 0.254: C14.2 15.27,16.98 15.27,17.25 14.86,17.25 v14.77,17.35
  Bottom 0.254: R17.2 14.62,17.2 v14.77,17.35
N$20
  Bottom 0.152: IC1.24 31.85,9 32.85,9 C26.2 C27.2 R33.1
N$21  (via drill 0.35)
  Top 0.152: U1.5 20.85,16.6 C16.1 20.65,16.4 C15.2
  Top 0.254: C15.2 18.8,16.4 18.02,15.62 15.37,15.62 v14.99,15.24
  Bottom 0.254: R18.2 14.3,15.8 14.86,15.24 v14.99,15.24
N$22
  Bottom 0.152: IC1.30 28.3,6.95 C21.1 C22.1 | C22.1 31.49,5.45 | C22.1 42.45,5.35 50.8,13.7 50.8,19.85 R23.1
N$23
  Top 0.152: 25.35,12 U2.8 25.35,13.65 FLT2.TP
N$24  (via drill 0.35)
  Top 0.152: C17.1 19.2,14.85 C16.2 21.53,15.58 21.53,18.1 20.96,18.68 U1.6
  Top 0.254: v14.7,13.66 15.59,13.66 15.73,13.81 18.11,13.81 18.48,14.18 18.53,14.18 C17.1
  Bottom 0.254: v14.7,13.66 14.59,13.66 R19.2
N$25  (via drill 0.35)
  Top 0.152: 21.65,11.9 U2.1
  Top 0.254: v14.9,12.4 15.9,13.4 C18.1 19.76,12.79 19.79,12.79 20.59,11.98 21.02,11.98 21.09,11.9 21.65,11.9
  Bottom 0.254: R20.2 14.5,12.8 v14.9,12.4
N$27  (via drill 0.35)
  Top 0.152: U2.5 25.25,9.93 24.8,9.47 22.2,9.47 21.75,9.93 U2.4 U2.3 U2.2 20.38,11.23 C19.1
  Top 0.254: v15,11 15,11.7 15.68,12.38 19.62,12.38 20.35,11.65 C19.1
  Bottom 0.254: R21.2 14.05,11 v15,11
N$28
  Top 0.152: U1.8 20.9,20 FLT1.TP
N$30
  Top 0.152: C20.2 18.3,11.55 C19.2 20.15,9.7 R22.2 20.42,9.7 20.95,9.17 25.75,9.17 25.96,9.38 25.96,10.07 25.46,10.57 U2.6
N$33  (via drill 0.35)
  Top 0.61: C24.1 45.25,37 v46,37
  Bottom 0.61: v46,37 45.9,37.1 R29.1
  pour Bottom (isolate 0.254, rank 2, no thermals): 44.6,40 44.6,36.4 45,36 45,35.6 46.2,34.4 46.2,30 46.4,29.8 48.9,29.8 49.3,29.4 49.3,28.5 50.5,28.5 50.5,33.6 50.4,33.7 49.3,33.7 47.2,35.8 47.2,40
N$34
  Bottom 0.254: R28.2 47.86,28.8 Q8.4 46.45,26.9 R32.2
N$35
  pour Bottom (no thermals): 44,39 44,40 45,41 47,41 47,43 40,43 39,42 39,40 40,39
N$36  (via drill 0.35)
  Top 0.254: D3.1 18.45,38.9 19.9,38.9 v20,38.8
  Bottom 0.254: v20,38.8 R46.2
N$37
  Top 0.61: C25.1 C24.2
N$38  (via drill 0.35)
  Top 0.152: v41.6,6.5 38.7,6.5 37.6,7.6 v37.6,7.7
  Bottom 0.152: 36,31 36.96,31 | v41.6,6.5 41.7,6.6 41.7,7.74 47.89,13.93 47.89,19.88 41.35,26.42 R30.2 | R33.2 37.45,7.85 v37.6,7.7
  Bottom 0.254: IC2.1 43.7,32.3 44,32 | R30.2 41.65,29.35 41,30 42,31 43.14,31 Q8.9 | R35.2 35.15,30.15 36,31
  pour Bottom (no thermals): 35,36 35,30 35,29 35.8,28.2 45.7,28.2 45.7,33.2 45.7,33.9 43.6,36 40.8,36 40.6,35.8 40.6,33.2 38.6,33.2 38.5,33.3 38.5,35.9 38.2,36.2 35.2,36.2
N$39  (via drill 0.35)
  Top 0.152: v42.5,27.55 v40.25,27.55
  Bottom 0.152: R31.2 R30.1 | IC2.4 40,34.69 40,35.8 40.5,36.3 44,36.3 45.85,34.45 45.85,28.05 45.35,27.55 v42.5,27.55
  Bottom 0.254: IC2.4 39.69,34.59 | R30.1 39.65,26.95 v40.25,27.55
N$40
  Bottom 0.152: IC1.29 28.7,7.48 29.28,6.9 31.5,6.9 32.7,5.7 42.1,5.7 48.3,11.9 48.3,20.98 44.22,25.05 44.22,26.37 R32.1
N$41
  Bottom 0.152: IC1.28 29.1,7.61 29.4,7.31 31.55,7.31 32.85,6 39.5,6 45.9,12.4 45.9,20.9 41.8,25 38,25 36.65,26.35 R31.1
  Bottom 0.254: R31.1 36.7,26.55
N$43
  pour Bottom (no thermals): 31.4,41.9 38.2,41.9 38.2,39.2 37.5,38.5 31.3,38.5 31.3,41.8
N$44  (via drill 0.35)
  Top 0.152: v37.3,12.6 37.33,12.57 44.57,12.57 46.1,14.1 | SV1.3 49.43,17.43 46.1,14.1 | J3.3 47.61,14.1 46.1,14.1
  Bottom 0.152: R47.1 35.9,13.6 36.9,12.6 v37.3,12.6 | D4.1 50,18.3 SV1.3
N$45  (via drill 0.35)
  Top 0.152: v23.14,34.1 30.9,34.1 v31.7,33.3
  Bottom 0.152: Q7.3 23.1,31.9 23.1,33.94 23.04,34 v23.14,34.1 | v31.7,33.3 32.28,33.31
  Bottom 0.254: Z1.1 32.56,34.41 R37.1 32.62,33.65 | 32.62,33.65 32.92,32.92 Q6.4 | 32.28,33.31 32.62,33.65 | Q7.3 21.05,31.7 R38.2
N$46
  Bottom 0.254: IC3.4 34.39,34.59 34.39,27.95 33.55,27.1 R35.1 31.05,27.1 29.7,28.45 R36.2
N$47
  Bottom 0.254: R36.1 29.05,26.75 Q10.3
N$48  (via drill 0.35)
  Top 0.152: v28.2,20.2 28.2,15.6 27,14.4 27,7.9 27.4,7.5 29.1,7.5 v29.6,8
  Bottom 0.152: IC1.26 29.9,8.3 v29.6,8 | v28.2,20.2 28.2,22.78 27.07,23.91 27.07,28.84 24.95,30.95 20.09,30.95 R38.1
N$49  (via drill 0.35)
  Top 0.152: v30.54,17.8 30.23,18.11 29,18.11 28.69,18.41 28.69,21.21 27.5,22.4 v26.8,22.4
  Bottom 0.152: v26.8,22.4 26.32,22.88 26.32,26.68 26.05,26.95 Q10.1 | IC1.16 30.3,17.55 v30.54,17.79 v30.54,17.8
  Bottom 0.254: R39.2 25.39,27.05 Q10.1
N$50  (via drill 0.35)
  Top 0.254: v29.2,18.6 29.2,19.5 30.1,20.4 v55.9,20.4
  Bottom 0.152: v55.9,20.4 56,20.4 56,25.05 R40.1
  Bottom 0.254: Q11.3 29.1,18.5 v29.2,18.6
N$51  (via drill 0.35)
  Top 0.152: v31.8,17.3 31.6,17.1 29.4,17.1 v28.7,16.4
  Bottom 0.152: IC1.12 v28.7,16.4 27.35,16.4 C28.2 | v31.8,17.3 31.8,16.84 Q11.2
  Bottom 0.254: R41.2 32.8,16.55 Q11.2
N$52
  Bottom 0.152: R42.2 32.8,18.45 Q11.1 30.4,18.45 29.9,17.95 IC1.15
N$53
  Bottom 0.254: Z2.1 22.85,37.59 R45.2 22.34,35.39 Q7.1 22.05,34.1 20.2,35.95 R46.1
N$54  (via drill 0.35)
  Top 0.152: v27.65,14.25 36.35,14.25 X1.1
  Bottom 0.152: IC1.10 27.9,14 v27.65,14.25
N$55  (via drill 0.35)
  Top 0.152: v28.15,14.85 34.41,14.85 X1.2
  Bottom 0.152: v28.15,14.85 28.3,14.7 IC1.11
N$56  (via drill 0.35)
  Top 0.152: v37,11.9 37.87,11.03 49.06,11.03 50.02,11.98 | 50.02,11.98 51,12.97 51,17.33 SV1.2 | 50.02,11.98 50.02,13.11 J3.4
  Bottom 0.152: v37,11.9 36.7,12.2 R50.1 | D5.1 51.97,15.7 SV1.2
N$57
  Bottom 0.152: LED6.C LED5.A 43.28,18.03 42.86,18.03 42.72,17.89 42.72,15.33 42.95,15.1 LED2.A LED1.C 43.35,13.6 40.86,11.11 32.97,11.11 32.48,11.6 IC1.20
N$58
  Bottom 0.152: LED6.A LED5.C 44.47,18.1 43.64,17.27 43.52,17.27 LED4.C LED3.A 44.1,16.1 44.1,13.73 41.14,10.77 32.78,10.77 32.42,11.13 30.92,11.13 IC1.21
N$59
  Bottom 0.152: IC1.18 30.88,12.37 32.67,12.37 33.9,13.6 R47.2
N$60
  Bottom 0.152: R48.1 44.95,46.5 S2.2 S2.1
N$61  (via drill 0.35)
  Top 0.152: C29.2 31.08,7.83 v30.33,7.83
  Bottom 0.152: R27.1 33.95,24 42,24 45.59,20.41 45.59,12.5 39.4,6.3 33.18,6.3 31.66,7.83 v30.33,7.83 30.33,9.42 IC1.25
N$62
  Bottom 0.152: LED4.A LED3.C LED2.C LED1.A 44.85,13.85 41.43,10.43 32.57,10.43 32.2,10.8 IC1.22
N$63
  Bottom 0.152: 33.68,15.27 R51.1 33.92,15.03 33.9,19.12 33.62,19.5 28.2,19.5 27.71,20 27.71,22.19 26.63,23.27 26.63,28.85 24.88,30.59 18.92,30.59 18.1,31.42 18.1,48.6 17.3,49.4 | 17.4,48.5 D6.1 17.3,49.4 | 17.3,49.4 17.3,50.7 SV2.3
N$64
  Bottom 0.152: IC1.19 30.88,12.03 33.88,12.03 R50.2
N$67  (via drill 0.35)
  Top 0.152: v35.7,17.3 35.1,16.7 30,16.7 29.29,15.99 29.29,15.9 v29.19,15.8
  Bottom 0.152: v29.19,15.8 29.1,15.71 IC1.13 | S1.2 S1.1 35.7,22.05 v35.7,17.3
N$68
  Bottom 1.016: C30.1 C31.2
PACK+  (via drill 0.35)
  Top 0.508: 34.3,39.7 28,39.7 v27.6,40.1
  Top 0.61: C25.2 34.3,39.7
  Bottom 0.152: S2.4 S2.3 42.15,52.6 35,52.6 J2.2
  Bottom 0.254: 27.12,29.88 27,30
  Bottom 0.508: v27.6,40.1 27.6,41.1
  Bottom 1.016: C31.1 20.75,51.61 SV2.4
  Bottom 1.27: SV2.4 SV2.5 24.28,52.6 35,52.6
  pour Bottom (no thermals): 31,28 33.6,28 34.1,28.5 34.1,31.5 33.8,31.8 32.4,31.8 31.1,33.1 31.1,37.3 30,38.4 30,48 31,49 37,49 38,50 38,56 36,58 23.6,58 23.6,32.4 26,30 30,30 31,29
PACK-  (via drill 0.35)
  Top 0.152: R9.1 15.9,44.6 14.8,43.5 14.8,42.5 v14.89,42.5
  Top 1.27: 15.9,44.6 15.9,50.16 SV2.2 SV2.1
  Bottom 0.152: R8.1 16.77,14.53 16.77,14.82 16.82,14.88 16.09,15.61 16.09,41.3 v14.89,42.5
  Bottom 0.254: v17,42 16.4,41.4 16.4,23.2 18.64,20.96 SJ1.1
  Bottom 1.016: C30.2 15.19,52.86 SV2.2 15.06,49.84 D6.2
  pour Top (no thermals): 15,47 16.7,48.7 38.6,48.7 38.6,43.6 36,41 17,41 15,43
PRESS/SHTDWN
  Bottom 0.152: IC1.17 32.5,14.45 R51.2

### Text on the board
bPlace: PACK+ | PACK- | 1N | 7P | 7P | 6P | 7P | 2P
tNames: SMBD | SMBC | G
bNames: P+ | P-